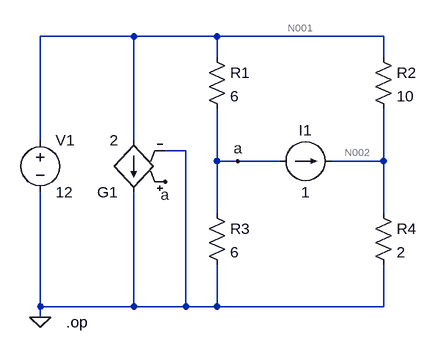
[diagram p0: schematic CH03-KP3-09.asc]
CH03-KP3-09.asc, the LTspice schematic file:
Version 4
SHEET 1 880 680
WIRE 272 128 128 128
WIRE 400 128 272 128
WIRE 656 128 400 128
WIRE 400 160 400 128
WIRE 656 160 656 128
WIRE 128 288 128 128
WIRE 272 288 272 128
WIRE 352 304 320 304
WIRE 400 320 400 240
WIRE 432 320 400 320
WIRE 496 320 432 320
WIRE 656 320 656 240
WIRE 656 320 576 320
WIRE 400 400 400 320
WIRE 656 400 656 320
WIRE 128 544 128 368
WIRE 272 544 272 368
WIRE 272 544 128 544
WIRE 352 544 352 304
WIRE 352 544 272 544
WIRE 400 544 400 480
WIRE 400 544 352 544
WIRE 656 544 656 480
WIRE 656 544 400 544
WIRE 128 560 128 544
FLAG 128 560 0
FLAG 432 320 a
FLAG 320 352 a
DATAFLAG 400 384 "$"
SYMBOL res 384 144 R0
SYMATTR InstName R1
SYMATTR Value 6
SYMBOL res 640 144 R0
SYMATTR InstName R2
SYMATTR Value 10
SYMBOL res 384 384 R0
SYMATTR InstName R3
SYMATTR Value 6
SYMBOL res 640 384 R0
SYMATTR InstName R4
SYMATTR Value 2
SYMBOL voltage 128 272 R0
SYMATTR InstName V1
SYMATTR Value 12
SYMBOL g 272 384 R180
SYMATTR InstName G1
SYMATTR Value 2
SYMBOL current 496 320 R270
WINDOW 0 32 40 VTop 2
WINDOW 3 -32 40 VBottom 2
SYMATTR InstName I1
SYMATTR Value 1
TEXT 168 568 Left 2 !.op

The netlist it stands for:
* CH03-KP3-09.asc
R1 N001 a 6
R2 N001 N002 10
R3 a 0 6
R4 N002 0 2
V1 N001 0 12
G1 N001 0 a 0 2
I1 a N002 1
.op
.backanno
.end

* Results of the author's LTspice run, read from the files saved beside the schematic
* Operating Point:
*   V(n001) = 12 V
*   V(a) = 3 V
*   V(n002) = 3.667 V
*   I(I1) = 1 A
*   I(R1) = 1.5 A
*   I(R2) = 833.3 mA
*   I(R3) = 500 mA
*   I(R4) = 1.833 A
*   I(G1) = 6 A
*   I(V1) = -8.333 A